# EAGLE design sch_puertosx4 (EAGLE 9.6.2)
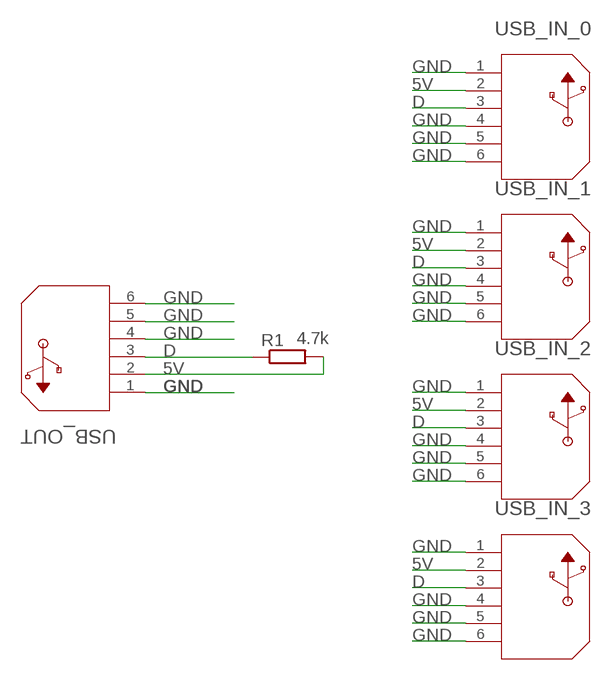
[diagram p0: schematic, sheet 1]

## Parts
R1  4.7k  R-EU_0309/10  [0309/10]
USB_IN_0  292303-3  [CONN4_292303_TEC]
USB_IN_1  292303-3  [CONN4_292303_TEC]
USB_IN_2  292303-3  [CONN4_292303_TEC]
USB_IN_3  292303-3  [CONN4_292303_TEC]
USB_OUT  292303-3  [CONN4_292303_TEC]

## Nets
5V: R1.2 USB_IN_0.2 USB_IN_1.2 USB_IN_2.2 USB_IN_3.2 USB_OUT.2
D: R1.1 USB_IN_0.3 USB_IN_1.3 USB_IN_2.3 USB_IN_3.3 USB_OUT.3
GND: USB_IN_0.1 USB_IN_0.4 USB_IN_0.5 USB_IN_0.6 USB_IN_1.1 USB_IN_1.4 USB_IN_1.5 USB_IN_1.6 USB_IN_2.1 USB_IN_2.4 USB_IN_2.5 USB_IN_2.6 USB_IN_3.1 USB_IN_3.4 USB_IN_3.5 USB_IN_3.6 USB_OUT.1 USB_OUT.4 USB_OUT.5 USB_OUT.6

## Library data of the parts
R1 = rcl:R-EU_: RESISTOR, European symbol; SPICEPREFIX: R
USB_IN_0 USB_IN_1-USB_IN_3 USB_OUT = USB_A_TH:292303-3; BUILT_BY: EMA_UL_Team; COPYRIGHT: Copyright (C) 2016 Accelerated Designs. All rights reserved; DESCRIPTION: USB A R/A RCPT ASSY THRU HOLE, LEAD FREE; MANUFACTURER_PART_NUMBER: 292303-3; PITCH_MM_: 2.5; POSITIONS: 4; PRODUCT: Connector; ROWS-CONFIG: 1; SOURCELIBRARY: TE_Connectivity-2018-03-16; TE_PART_NUMBER: 292303-3; TYPE: USB 2.0; VENDOR: TE Connectivity

## Board
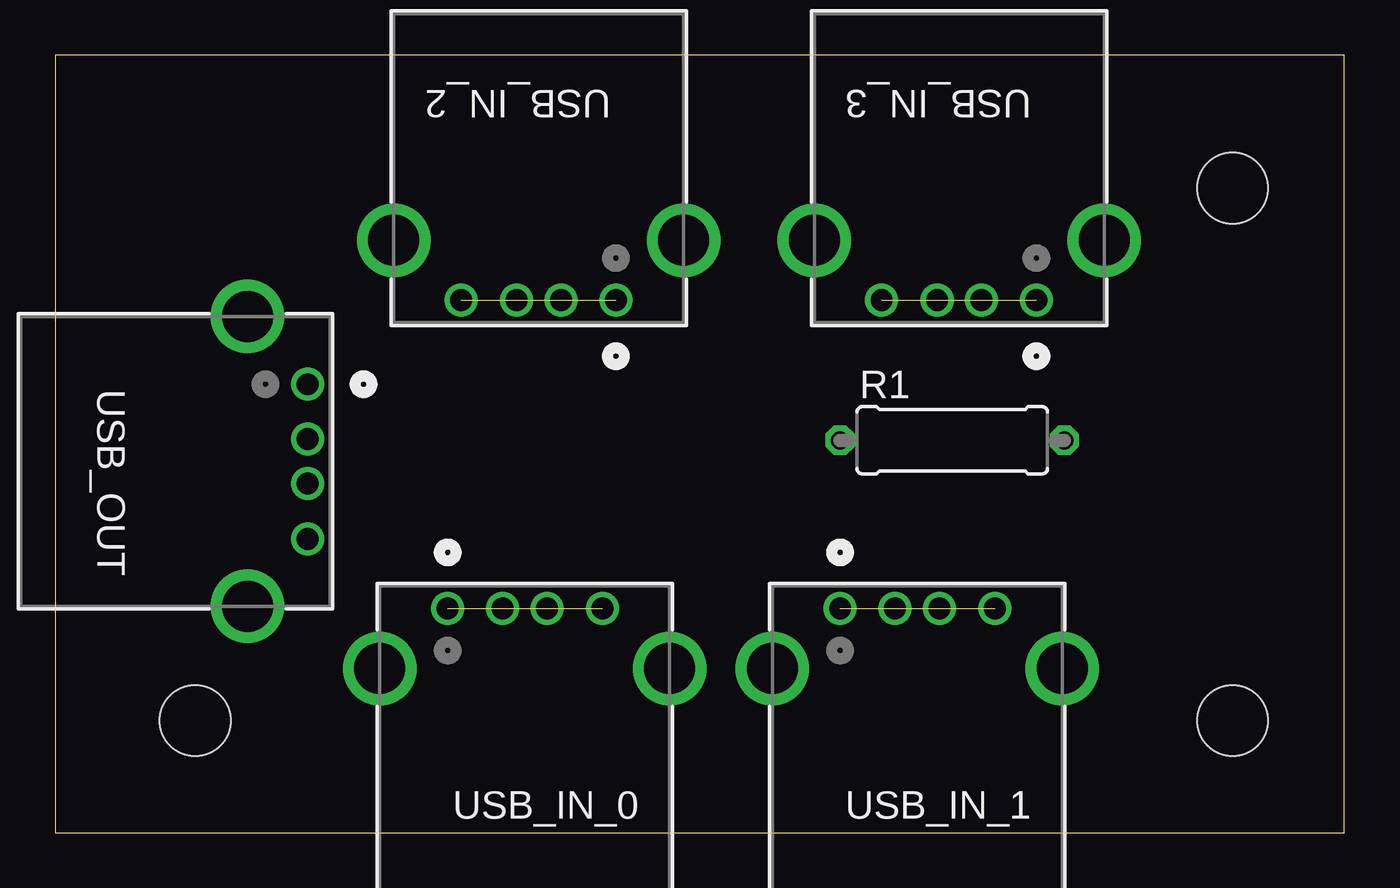
[diagram p1: board, top side]
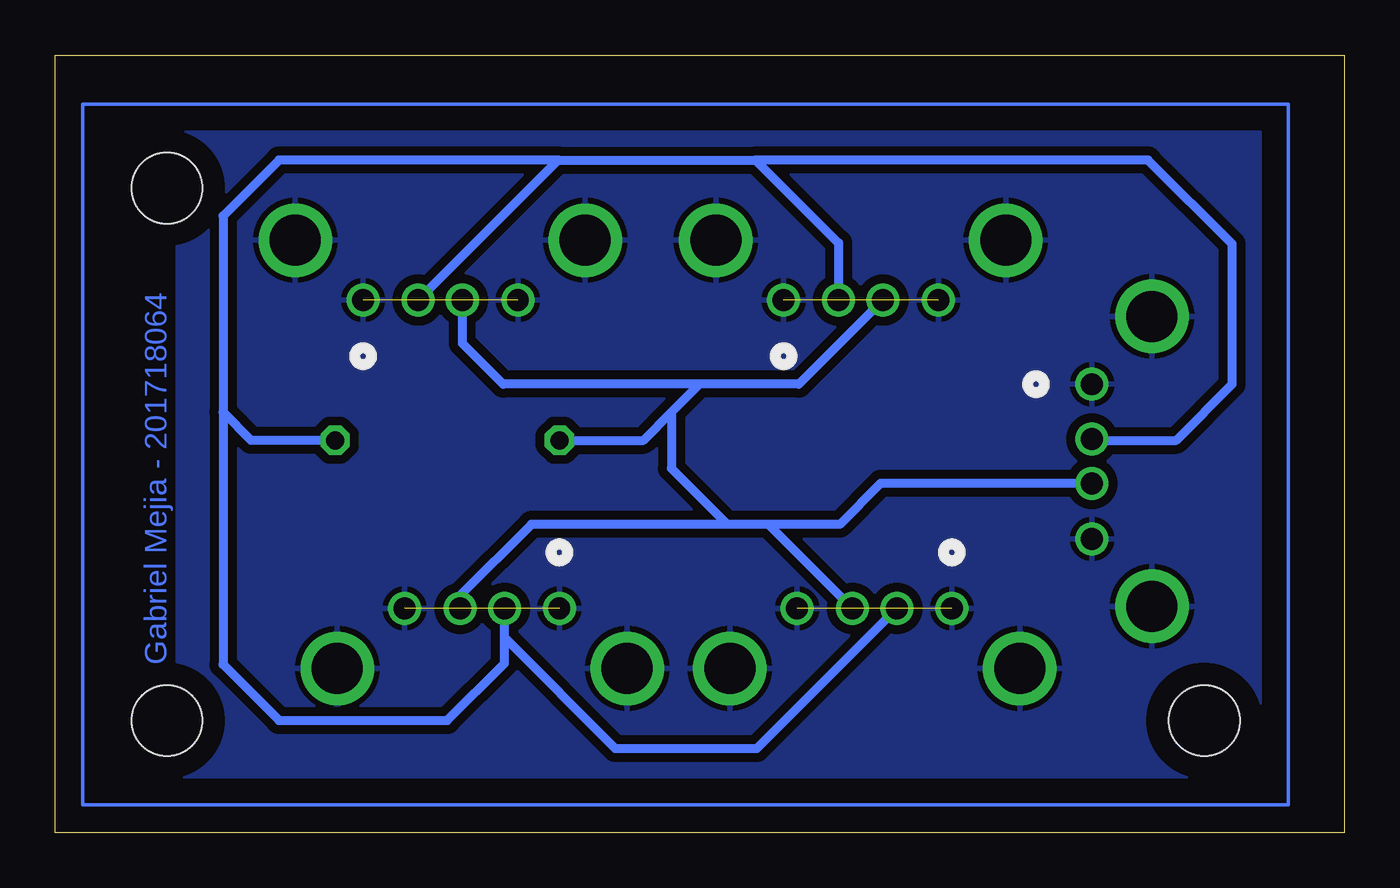
[diagram p2: board, bottom side, seen from below]

Size 58.4 x 35.23 mm. Coordinates in mm from the lower left corner, seen from the top.
Outline: 0,0 58.4,0 58.4,35.23 0,35.23 0,0
Copper layers (1*16): Top 0.035mm / dielectric 1.5mm / Bottom 0.035mm
Design rules "default": minimum track width 6mil, minimum drill 0.35mm, track to track 6mil, track to pad 6mil, pad to pad 6mil, via to via 6mil, smd to smd 6mil, copper to edge 40mil, drill to drill 6mil, minimum pad ring 10mil, minimum via ring 8mil, stop-mask expansion 4mil, vias tented up to drill 0mil, thermal gap 10mil
Holes 3.2 mm at 53.34,29.21 53.34,5.08 6.35,5.08

### Footprints (pad centres in the part's own frame; a part is rotated, then mirrored left to right if it is on the bottom)
0309/10 = drill 0.813 octagon: 1 -5.08,0; 2 5.08,0
CONN4_292303_TEC = drill 0.991 pad 1.499: 1 0,0; 2 2.489,0; 3 4.496,0; 4 7.01,0 | drill 2.311 pad 2.819: 5 -3.073,-2.718; 6 10.058,-2.718

### Placement (x,y rotation side)
R1  40.64,17.78 0 top
USB_IN_0  17.78,10.16 0 top
USB_IN_1  35.56,10.16 0 top
USB_IN_2  25.4,24.13 180 top
USB_IN_3  44.45,24.13 180 top
USB_OUT  11.43,20.32 270 top

### Tracks (layer width: path | path; a pad name or v marks a point on that pad's centre or on a via)
5V  (via drill 0.35)
  Top 0.152: USB_OUT.2 v11.38,17.78
  Bottom 0.406: USB_IN_0.2 26.62,3.81 33.02,3.81 38.05,8.84 | 38.05,8.84 USB_IN_1.2 | USB_IN_3.2 35.61,30.48 | 35.61,30.48 26.67,30.48 | 26.67,30.48 22.91,26.72 USB_IN_2.2 | 35.61,30.48 48.26,30.48 50.8,27.94 50.8,19.05 | 50.8,19.05 50.8,7.62 48.26,5.08 40.64,5.08 38.05,7.67 38.05,8.84 | R1.2 49.53,17.78 50.8,19.05 | v11.38,17.78 7.62,17.78 5.08,20.32 5.08,26.67 8.89,30.48 26.67,30.48
D
  Bottom 0.406: USB_IN_2.3 24.71,20.32 29.21,20.32 | 29.21,20.32 38.1,20.32 39.95,22.17 USB_IN_3.3 | USB_IN_0.3 26.09,13.97 | 26.09,13.97 27.94,13.97 | 27.94,13.97 36.83,13.97 40.06,10.74 USB_IN_1.3 | 29.21,20.32 30.48,19.05 | 30.48,19.05 30.48,16.51 27.94,13.97 | R1.1 31.75,17.78 30.48,19.05 | USB_OUT.3 21.01,15.82 22.86,13.97 26.09,13.97
GND  (4 unrouted)
  pour Bottom (isolate 0.406): 3.81,31.75 55.88,31.75 55.88,2.54 3.81,2.54
N$1
  Bottom 0.152: 2.54,33.02 57.15,33.02 57.15,1.27 2.54,1.27 2.54,33.02

### Text on the board
Bottom: Gabriel Mejia - 201718064